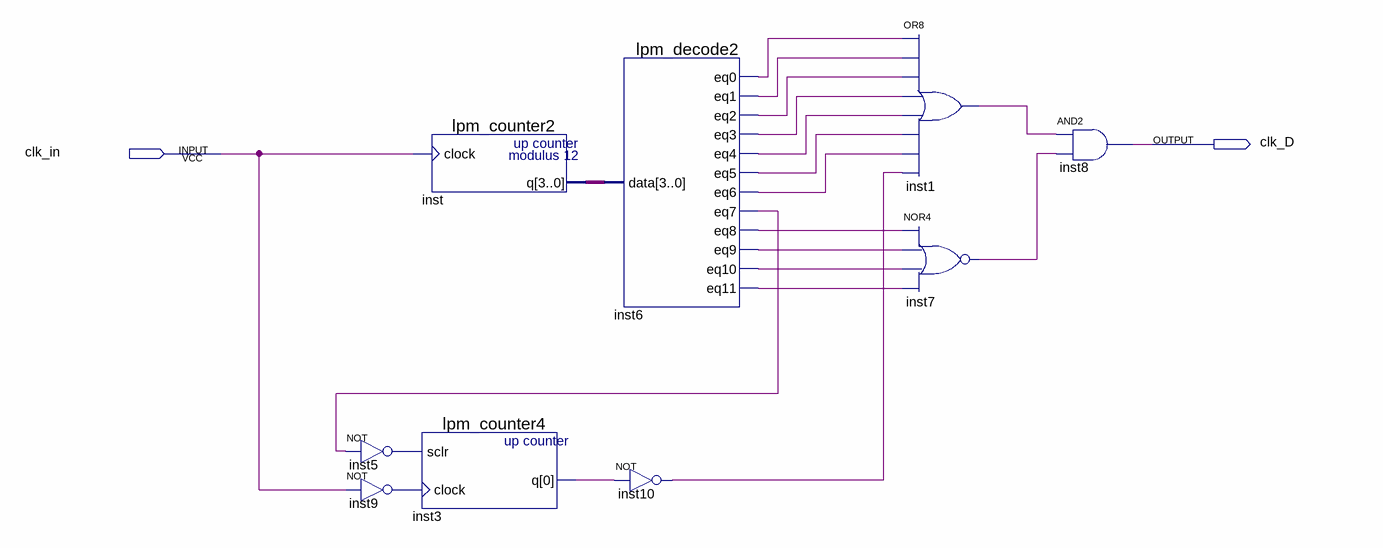
[diagram p0: schematic sheet]
// Quartus schematic block2.bdf as structural Verilog: 9 symbols, 2 pins
module block2 (
  input  clk_in,
  output clk_D
);

  wire inst1_out, inst3_q, inst5_out, inst6_eq0, inst6_eq1, inst6_eq2, inst6_eq3, inst6_eq4, inst6_eq5,
       inst6_eq6, inst6_eq7, inst6_eq8, inst6_eq9, inst6_eq10, inst6_eq11, inst7_out, inst9_out, inst10_out;
  wire [3:0] inst_q;

  not inst5 (inst5_out, inst6_eq7);
  not inst9 (inst9_out, clk_in);
  lpm_counter2 inst (.clock(clk_in), .q(inst_q));
  lpm_counter4 inst3 (.sclr(inst5_out), .clock(inst9_out), .q(inst3_q));
  lpm_decode2 inst6 (
    .data(inst_q), .eq0(inst6_eq0), .eq1(inst6_eq1), .eq2(inst6_eq2), .eq3(inst6_eq3), .eq4(inst6_eq4),
    .eq5(inst6_eq5), .eq6(inst6_eq6), .eq7(inst6_eq7), .eq8(inst6_eq8), .eq9(inst6_eq9), .eq10(inst6_eq10),
    .eq11(inst6_eq11));
  not inst10 (inst10_out, inst3_q);
  or inst1 (inst1_out, inst6_eq0, inst6_eq1, inst6_eq2, inst6_eq3, inst6_eq4, inst6_eq5, inst6_eq6, inst10_out);
  nor inst7 (inst7_out, inst6_eq8, inst6_eq9, inst6_eq10, inst6_eq11);
  and inst8 (clk_D, inst1_out, inst7_out);
endmodule
